# Altium schematic sheet OLDI DISPLAY INTERFACE.SchDoc
size A3; DocumentNumber: 8; SheetNumber: 9; SheetTotal: 14
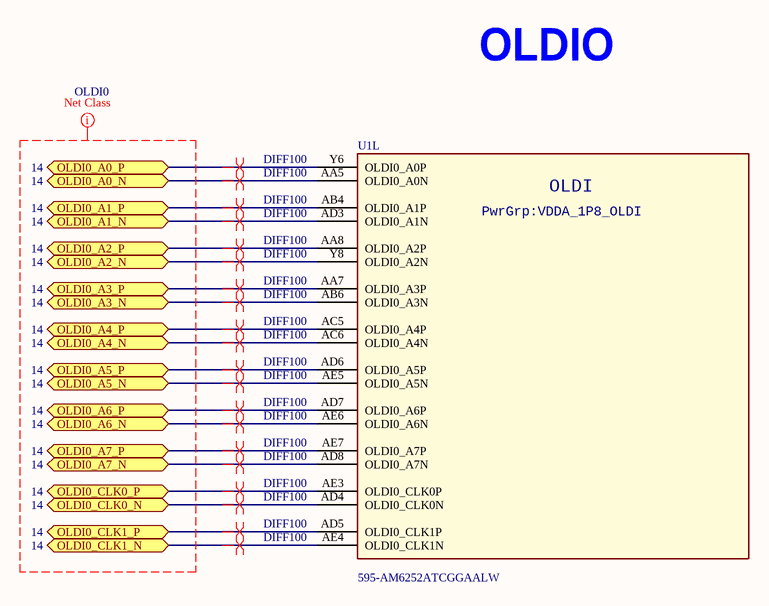
[diagram p0: OLDI DISPLAY INTERFACE.SchDoc]

## Parts
U1  Supplier Part Number 1: 595-AM6252ATCGGAALW  [BGA425C50P25X25_1300X1300X89]  (hidden comment: AM62-EVM_BGA425)  (part L of 18)

## Ports
OLDI0_A0_N (bidir, see 14), OLDI0_A0_P (bidir, see 14), OLDI0_A1_N (bidir, see 14), OLDI0_A1_P (bidir, see 14), OLDI0_A2_N (bidir, see 14), OLDI0_A2_P (bidir, see 14), OLDI0_A3_N (bidir, see 14), OLDI0_A3_P (bidir, see 14), OLDI0_A4_N (bidir, see 14), OLDI0_A4_P (bidir, see 14), OLDI0_A5_N (bidir, see 14), OLDI0_A5_P (bidir, see 14), OLDI0_A6_N (bidir, see 14), OLDI0_A6_P (bidir, see 14), OLDI0_A7_N (bidir, see 14), OLDI0_A7_P (bidir, see 14), OLDI0_CLK0_N (bidir, see 14), OLDI0_CLK0_P (bidir, see 14), OLDI0_CLK1_N (bidir, see 14), OLDI0_CLK1_P (bidir, see 14)

## Nets
OLDI0_A0_N: U1.AA5(OLDI0_A0N) ; port OLDI0_A0_N
OLDI0_A0_P: U1.Y6(OLDI0_A0P) ; port OLDI0_A0_P
OLDI0_A1_N: U1.AD3(OLDI0_A1N) ; port OLDI0_A1_N
OLDI0_A1_P: U1.AB4(OLDI0_A1P) ; port OLDI0_A1_P
OLDI0_A2_N: U1.Y8(OLDI0_A2N) ; port OLDI0_A2_N
OLDI0_A2_P: U1.AA8(OLDI0_A2P) ; port OLDI0_A2_P
OLDI0_A3_N: U1.AB6(OLDI0_A3N) ; port OLDI0_A3_N
OLDI0_A3_P: U1.AA7(OLDI0_A3P) ; port OLDI0_A3_P
OLDI0_A4_N: U1.AC6(OLDI0_A4N) ; port OLDI0_A4_N
OLDI0_A4_P: U1.AC5(OLDI0_A4P) ; port OLDI0_A4_P
OLDI0_A5_N: U1.AE5(OLDI0_A5N) ; port OLDI0_A5_N
OLDI0_A5_P: U1.AD6(OLDI0_A5P) ; port OLDI0_A5_P
OLDI0_A6_N: U1.AE6(OLDI0_A6N) ; port OLDI0_A6_N
OLDI0_A6_P: U1.AD7(OLDI0_A6P) ; port OLDI0_A6_P
OLDI0_A7_N: U1.AD8(OLDI0_A7N) ; port OLDI0_A7_N
OLDI0_A7_P: U1.AE7(OLDI0_A7P) ; port OLDI0_A7_P
OLDI0_CLK0_N: U1.AD4(OLDI0_CLK0N) ; port OLDI0_CLK0_N
OLDI0_CLK0_P: U1.AE3(OLDI0_CLK0P) ; port OLDI0_CLK0_P
OLDI0_CLK1_N: U1.AE4(OLDI0_CLK1N) ; port OLDI0_CLK1_N
OLDI0_CLK1_P: U1.AD5(OLDI0_CLK1P) ; port OLDI0_CLK1_P

## Layout directives
differential pair; net class DIFF100: OLDI0_A0_N, OLDI0_A0_P, OLDI0_A1_N, OLDI0_A1_P, OLDI0_A2_N, OLDI0_A2_P, OLDI0_A3_N, OLDI0_A3_P, OLDI0_A4_N, OLDI0_A4_P, OLDI0_A5_N, OLDI0_A5_P, OLDI0_A6_N, OLDI0_A6_P, OLDI0_A7_N, OLDI0_A7_P, OLDI0_CLK0_N, OLDI0_CLK0_P, OLDI0_CLK1_N, OLDI0_CLK1_P
net class OLDI0: (no net found under the mark)

## Notes on the sheet
- OLDIO
- (in symbol AM62-EVM_BGA425, part L) OLDI; PwrGrp:VDDA_1P8_OLDI

## Library data of the parts
U1 = AM62-EVM_BGA425: ARM® Cortex®-A53 Microprocessor IC Sitara™ 2 Core, 64-Bit 1.4GHz 425-FCCSP (13x13); Manufacturer: Texas Instruments; Manufacturer Part Number: AM6252ATCGGAALW; Supplier 1: Mouser; Stock 1: 0; Pricing 1: 1=21.23, 10=19.58, 50=18.7, 100=18.7, 1000=15.94, 10000=15.94 (USD)